# Altium schematic sheet bout.SchDoc
size A4; SheetNumber: 3; SheetTotal: 4
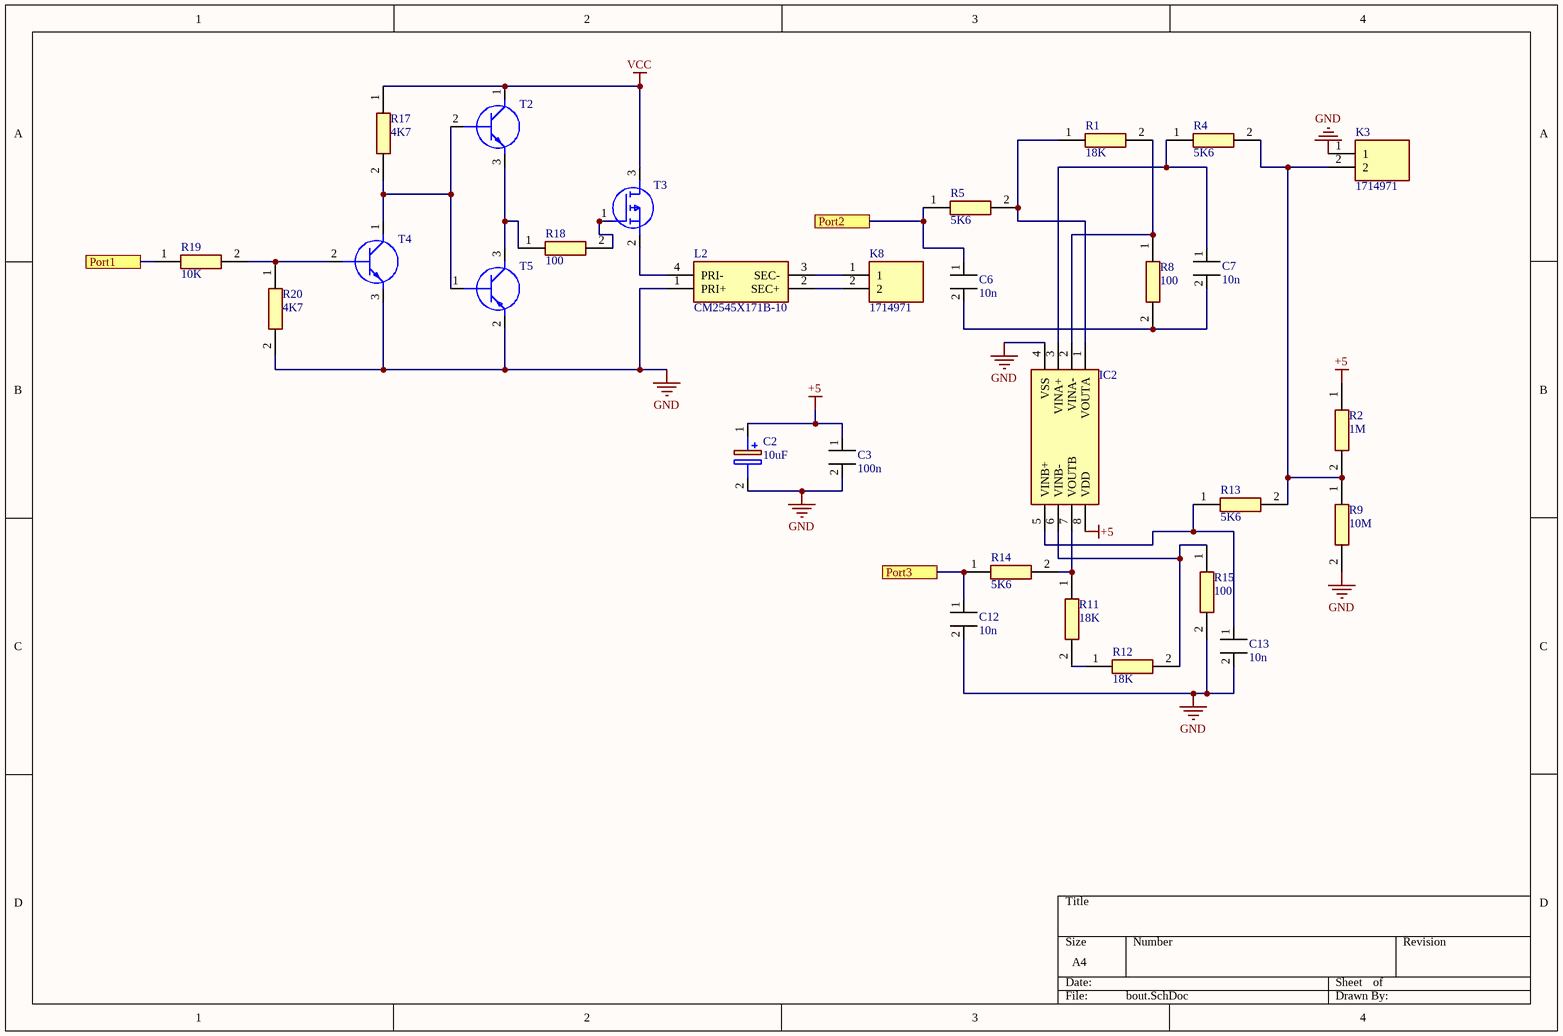
[diagram p0: bout.SchDoc]

## Parts
C2  10uF  [RCE7U2J103J3K1H03B]
C3  100n  [FP-CRCW0805-e3-IPC_A]
C6  10n  [FP-CRCW0805-e3-IPC_A]
C7  10n  [FP-CRCW0805-e3-IPC_A]
C12  10n  [FP-CRCW0805-e3-IPC_A]
C13  10n  [FP-CRCW0805-e3-IPC_A]
IC2  MCP6002-I_P  [DIP781W56P254L950H533Q8N]  (value not drawn)
K3  1714971  [1714971]
K8  1714971  [1714971]
L2  CM2545X171B-10  [CM2545X171B10]
R1  18K  [FP-CRCW0805-e3-IPC_A]
R2  1M  [FP-CRCW0805-e3-IPC_A]
R4  5K6  [FP-CRCW0805-e3-IPC_A]
R5  5K6  [FP-CRCW0805-e3-IPC_A]
R8  100  [FP-CRCW0805-e3-IPC_A]
R9  10M  [FP-CRCW0805-e3-IPC_A]
R11  18K  [FP-CRCW0805-e3-IPC_A]
R12  18K  [FP-CRCW0805-e3-IPC_A]
R13  5K6  [FP-CRCW0805-e3-IPC_A]
R14  5K6  [FP-CRCW0805-e3-IPC_A]
R15  100  [FP-CRCW0805-e3-IPC_A]
R17  4K7  [FP-CRCW0805-e3-IPC_A]
R18  100  [FP-CRCW0805-e3-IPC_A]
R19  10K  [FP-CRCW0805-e3-IPC_A]
R20  4K7  [FP-CRCW0805-e3-IPC_A]
T2  BC547CBU  [BC547CBU]  (value not drawn)
T3  IRF9Z34NPBF  [TO254P469X1042X1967-3P]  (value not drawn)
T4  BC547CBU  [BC547CBU]  (value not drawn)
T5  BCX71K,215  [SOT95P230X110-3N]  (value not drawn)

## Ports
Port1, Port2, Port3

## Nets
+5: C2.1(+) C3.1(+) IC2.8(VDD) R2.1
GND: C2.2(-) C3.2(-) C12.2(-) C13.2(-) IC2.4(VSS) K3.1 L2.1(PRI+) R9.2 R15.2 R20.2 T4.3(E) T5.2(E)
VCC: R17.1 T2.1(C) T3.3(D)
Port1: R19.1 ; port Port1
Port2: C6.1(+) R5.1 ; port Port2
Port3: C12.1(+) R14.1 ; port Port3
NetC6_2: C6.2(-) C7.2(-) R8.2
NetC7_1: C7.1(+) IC2.3(VINA+) R4.1
NetC13_1: C13.1(+) IC2.5(VINB+) R13.1
NetIC2_1: IC2.1(VOUTA) R1.1 R5.2
NetIC2_2: IC2.2(VINA-) R1.2 R8.1
NetIC2_6: IC2.6(VINB-) R12.2 R15.1
NetIC2_7: IC2.7(VOUTB) R11.1 R14.2
NetK3_2: K3.2 R2.2 R4.2 R9.1 R13.2
NetK8_1: K8.1 L2.3(SEC-)
NetK8_2: K8.2 L2.2(SEC+)
NetL2_4: L2.4(PRI-) T3.2(S)
NetR11_2: R11.2 R12.1
NetR17_2: R17.2 T2.2(B) T4.1(C) T5.1(B)
NetR18_1: R18.1 T2.3(E) T5.3(C)
NetR18_2: R18.2 T3.1(G)
NetR19_2: R19.2 R20.1 T4.2(B)

## Library data of the parts
C2 = Component_1
C3 C6 C7 C12 C13 = MAL215097101E3: Capacitor Polarised; Manufacturer_Name: Vishay; Datasheet Link: https://componentsearchengine.com/Datasheets/2/MAL215097101E3.pdf; Height: 10.5mm; Manufacturer_Part_Number: MAL215097101E3
IC2 = MCP6002-I_P: Integrated Circuit; Manufacturer_Name: Microchip; Manufacturer_Part_Number: MCP6002-I/P; Datasheet Link: https://componentsearchengine.com//MCP6002-I_P.pdf; Height: 5.334mm; Mouser2 Part Number: 579-MCP6002-I/P; Mouser2 Price/Stock: https://www.mouser.com/Search/Refine.aspx?Keyword=579-MCP6002-I%2FP
K3 K8 = 1714971: Connector; Manufacturer_Name: Phoenix Contact; Datasheet Link: https://componentsearchengine.com/Datasheets/2/1714971.pdf; Height: 21.7mm; Manufacturer_Part_Number: 1714971
L2 = CM2545X171B-10: Transformer; Manufacturer_Name: Laird Technologies; Datasheet Link: https://datasheet.datasheetarchive.com/originals/dk/DKDS-7/122753.pdf; Height: 9.5mm; Manufacturer_Part_Number: CM2545X171B-10
R1 R2 R4 R5 R8 R9 R11-R15 R17-R20 = CHP0805AFX-1000ELF: Resistor; Manufacturer_Name: Bourns; Datasheet Link: https://www.mouser.cn/datasheet/2/54/chp-a-1858677.pdf; Height: 0.6mm; Manufacturer_Part_Number: CHP0805AFX-1000ELF
T2 T4 = BC547CBU: Transistor BJT NPN; Manufacturer_Name: ON Semiconductor; Datasheet Link: https://www.onsemi.com/pdf/datasheet/bc550-d.pdf; Height: 5.33mm; Manufacturer_Part_Number: BC547CBU
T3 = IRF9Z34NPBF: MOSFET (P-Channel); Manufacturer_Name: Infineon; Datasheet Link: https://componentsearchengine.com//IRF9Z34NPBF.pdf; Height: 4.69mm; Mouser2 Part Number: 942-IRF9Z34NPBF; Mouser2 Price/Stock: https://www.mouser.com/Search/Refine.aspx?Keyword=942-IRF9Z34NPBF; Manufacturer_Part_Number: IRF9Z34NPBF
T5 = BCX71K,215: Transistor BJT PNP; Manufacturer_Name: Nexperia; Datasheet Link: http://assets.nexperia.com/documents/data-sheet/BCX71.pdf; Height: 1.1mm; Manufacturer_Part_Number: BCX71K,215